# Altium schematic sheet TPS61377_16V.SchDoc
size A4; SheetNumber: 3; SheetTotal: 27
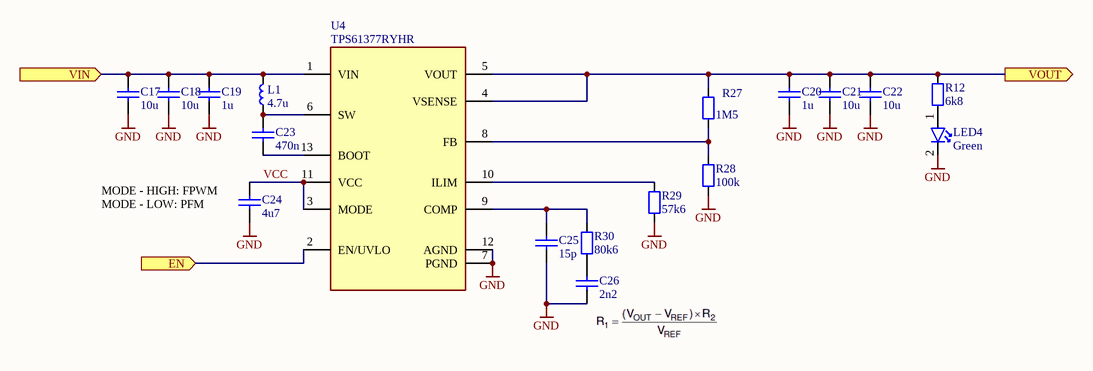
[diagram p0: TPS61377_16V.SchDoc]

## Parts
C17  10u  [C_1206_3216Metric_IPC_N]
C18  10u  [C_1206_3216Metric_IPC_N]
C19  1u  [C_0402_1005Metric_IPC_N]
C20  1u  [C_0402_1005Metric_IPC_N]
C21  10u  [C_1206_3216Metric_IPC_N]
C22  10u  [C_1206_3216Metric_IPC_N]
C23  470n  [C_0402_1005Metric_IPC_N]
C24  4u7  [C_0402_1005Metric_IPC_N]
C25  15p  [C_0402_1005Metric_IPC_N]
C26  2n2  [C_0402_1005Metric_IPC_N]
L1  4.7u  [L_1616_4040Metric_IPC_N]
LED4  Green  [LED_0603_1806Metric_IPC_N]
R12  6k8  [R_0402_1005Metric_IPC_N]
R27  1M5  [R_0402_1005Metric_IPC_N]
R28  100k  [R_0402_1005Metric_IPC_N]
R29  57k6  [R_0402_1005Metric_IPC_N]
R30  80k6  [R_0402_1005Metric_IPC_N]
U4  TPS61377RYHR  [VQFN13_2_5x2]

## Ports
EN (in, see Power_Supply[3B]), VIN (in, see Power_Supply[3B], AP62500_4V[1B], AP62500_6V[1B]), VOUT (out, see Power_Supply[3B])

## Nets
GND: C17.1 C18.1 C19.1 C20.1 C21.1 C22.1 C24.1 C25.1 C26.1 LED4.2 R28.1 R29.1 U4.7(PGND) U4.12(AGND)
EN: U4.2(EN/UVLO) ; port EN
VCC: C24.2 U4.3(MODE) U4.11(VCC)
VIN: C17.2 C18.2 C19.2 L1.2 U4.1(VIN) ; port VIN
VOUT: C20.2 C21.2 C22.2 R12.1 R27.2 U4.4(VSENSE) U4.5(VOUT) ; port VOUT
NetC23_1: C23.1 U4.13(BOOT)
NetC23_2: C23.2 L1.1 U4.6(SW)
NetC25_2: C25.2 R30.2 U4.9(COMP)
NetC26_2: C26.2 R30.1
NetLED4_1: LED4.1 R12.2
NetR27_1: R27.1 R28.2 U4.8(FB)
NetR29_2: R29.2 U4.10(ILIM)

## Notes on the sheet
- (near C24) MODE - HIGH: FPWM
  MODE - LOW: PFM

## Library data of the parts
C17 C18 C21 C22 = C000005: Generic MLCC with 1206 Footprint; Specific Component: False; Temp Coefficient: X7R; Voltage Rated: 50V; ID: C000005; Capacitance: 10u; Tolerance: *; min Temperature: *; max Temperature: *; Case: 1206
C19 C20 C25 C26 = C000002: Generic MLCC with 0402 Footprint; Specific Component: False; Temp Coefficient: X7R; Voltage Rated: 50V; ID: C000002; Tolerance: *; min Temperature: *; max Temperature: *; Case: 0402
  C19 C20: Capacitance: 1u
  C25: Capacitance: 15p
  C26: Capacitance: 2n2
C23 C24 = C000002: Generic MLCC with 0402 Footprint; Specific Component: False; ID: C000002; Tolerance: *; Temp Coefficient: *; Voltage Rated: *; min Temperature: *; max Temperature: *; Case: 0402
  C23: Capacitance: 470n
  C24: Capacitance: 4u7
L1 = L000015: Power Inductor, 4.7u, 5A, , 57m, 20%, 1616; Manufacturer: Coilcraft; Manufacturer Part Number: XFL4020-472MEC; Specific Component: True; Current - Saturation: 2.7A; min Temperature: -40; max Temperature: +125; ID: L000015; Type: Power Inductor; Inductance: 4.7u; Tolerance: 20%; Current Rating: 5A; DC resistance: 57m; Case: 1616; ComponentLink1Description: Datasheet; ComponentLink1URL: https://www.coilcraft.com/getmedia/50632d43-da1b-4cdb-8ab4-3029cab51df3/xfl4020.pdf; Supplier 1: Digikey; Supplier Part Number 1: 4652-XFL4020-472MEC-ND; Supplier 2: Mouser; Supplier Part Number 2: 994-XFL4020-472MEC
LED4 = LED000007: MLCC, Low Current, Green, 2.2V, 20mA, 0603; Manufacturer: Broadcom / Avago; Manufacturer Part Number: HSMG-C190; Specific Component: True; ID: LED000007; Type: Low Current; Colour: Green; Forward Voltage: 2.2V; Current: 20mA; Case: 0603; ComponentLink1Description: Datasheet; ComponentLink1URL: https://www.mouser.de/datasheet/3/57/1/AV02_0551EN_DS_HSMx_Cxxx_25Mar2022.pdf; Supplier 1: Mouser; Supplier Part Number 1: 630-HSMG-C190; Supplier 2: Digikey; Supplier Part Number 2: 516-1425-1-ND
R12 = R000002: Generic Chip Resistor with 0402 Footprint; Specific Component: False; ID: R000002; Resistance: 6k8; Tolerance: *; Power Rating: *; Composition: *; min Temperature: *; max Temperature: *; Temp Coefficient: *; Case: 0402
R27-R30 = R000002: Generic Chip Resistor with 0402 Footprint; Specific Component: False; Power Rating: 0.063W; ID: R000002; Tolerance: *; Composition: *; min Temperature: *; max Temperature: *; Temp Coefficient: *; Case: 0402
  R27: Resistance: 1M5
  R28: Resistance: 100k
  R29: Resistance: 57k6
  R30: Resistance: 80k6
U4 = PMIC000032: Manufacturer: Texas Instruments; ID: PMIC000032; Type: DC/DC; Manufacturer Part Number: TPS61377RYHR; Part Value: TPS61377RYHR; Case: VQFN-13 (2.5x2); ComponentLink1Description: Datasheet; ComponentLink1URL: https://www.ti.com/lit/ds/symlink/tps61377.pdf?ts=1770979054548&ref_url=https%253A%252F%252Fwww.ti.com%252Fproduct%252Fde-de%252FTPS61377; Supplier 1: Digikey; Supplier Part Number 1: 296-TPS61377RYHRCT-ND; Supplier 2: Mouser; Supplier Part Number 2: 595-TPS61377RYHR